# Altium project SparkFun_Motor_Driver-TB6612FNG_v11c.PrjPCB
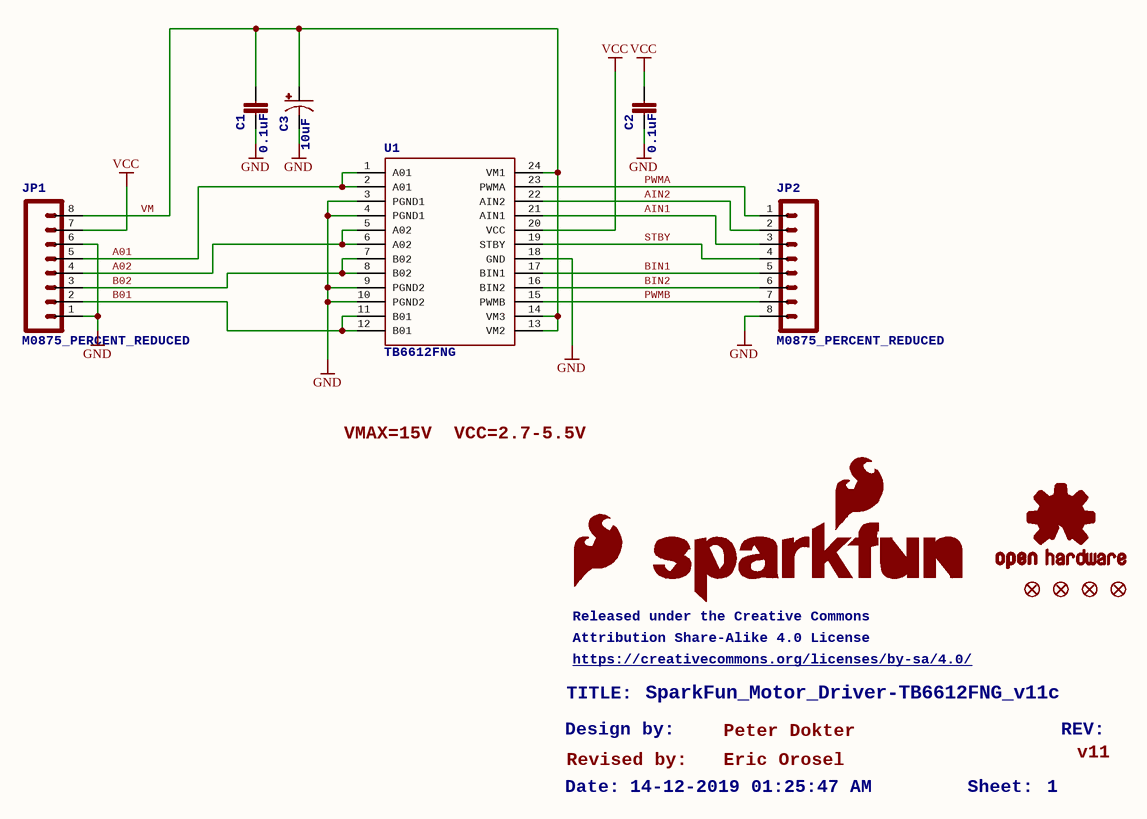
[diagram p0: SparkFun_Motor_Driver-TB6612FNG_v11c.SchDoc]
1 sheet, 13 parts. Net scope: global (net labels, ports and power ports of the same name join across sheets).

## Sheet SparkFun_Motor_Driver-TB6612FNG_v11c.SchDoc: SparkFun_Motor_Driver-TB6612FNG_v11c
size 270 x 207 mm; Date: 14-12-2019 01:25:47 AM; SheetNumber: 1

### Parts
C1  0.1uF  [0402]
C2  0.1uF  [0402]
C3  10uF  [EIA3528]
FD1  FIDUCIALUFIDUCIAL  [FIDUCIAL-MICRO]  (value not drawn)
FD2  FIDUCIALUFIDUCIAL  [FIDUCIAL-MICRO]  (value not drawn)
FD3  FIDUCIALUFIDUCIAL  [FIDUCIAL-MICRO]  (value not drawn)
FD4  FIDUCIALUFIDUCIAL  [FIDUCIAL-MICRO]  (value not drawn)
JP1  M0875_PERCENT_REDUCED  [1X08_OFFSET_REDUCED]
JP2  M0875_PERCENT_REDUCED  [1X08_OFFSET_REDUCED]
LOGO1  SFE_LOGO_FLAME.1_INCH  [SFE_LOGO_FLAME_.1]  (value not drawn)
LOGO2  OSHW-LOGOS  [OSHW-LOGO-S]  (value not drawn)
LOGO4  SFE_LOGO_NAME_FLAME.1_INCH  [SFE_LOGO_NAME_FLAME_.1]  (value not drawn)
U1  TB6612FNG  [SSOP24]

### Nets
GND: C1.2 C2.2 C3.C(-) JP1.1 JP1.6 JP2.8 U1.3(PGND1) U1.4(PGND1) U1.9(PGND2) U1.10(PGND2) U1.18(GND)
VCC: C2.1 JP1.7 U1.20(VCC)
A01: JP1.5 U1.1(A01) U1.2(A01)
A02: JP1.4 U1.5(A02) U1.6(A02)
AIN1: JP2.3 U1.21(AIN1)
AIN2: JP2.2 U1.22(AIN2)
B01: JP1.2 U1.11(B01) U1.12(B01)
B02: JP1.3 U1.7(B02) U1.8(B02)
BIN1: JP2.5 U1.17(BIN1)
BIN2: JP2.6 U1.16(BIN2)
PWMA: JP2.1 U1.23(PWMA)
PWMB: JP2.7 U1.15(PWMB)
STBY: JP2.4 U1.19(STBY)
VM: C1.1 C3.A(+) JP1.8 U1.13(VM2) U1.14(VM3) U1.24(VM1)

### Notes on the sheet
- VMAX=15V
  VCC=2.7-5.5V
- (near LOGO4) Released under the Creative Commons
- Attribution Share-Alike 4.0 License
- https://creativecommons.org/licenses/by-sa/4.0/
- Design by:
- TITLE:
- SparkFun_Motor_Driver-TB6612FNG_v11c
- Peter Dokter
- REV:
- Date:
- Revised by:
- 14-12-2019 01:25:47 AM
- Eric Orosel
- Sheet:
- 1
- v11

### Library data of the parts
C1 C2 = 0.1UF-0402-16V-10%: 0.1µF ceramic capacitors    A capacitor is a passive two-terminal electrical component used to store electrical energy temporarily in an electric field.
C3 = 10UF-POLAR-EIA3528-20V-10%(TANT): 10.0µF polarized capacitors    A capacitor is a passive two-terminal electrical component used to store electrical energy temporarily in an electric field.
FD1-FD4 = FIDUCIALUFIDUCIAL: Fiducial Alignment Points    Point-of-reference for pick-and-place machines and other optical instruments.
JP1 JP2 = M0875_PERCENT_REDUCED: Header 8Standard 8-pin 0.1" header. Use with straight break away headers (SKU : PRT-00116), right angle break away headers (PRT-00553), swiss pins (PRT-00743), machine pins (PRT-00117), and female headers (PRT-00115).
LOGO1 = SFE_LOGO_FLAME.1_INCH: SparkFun Flame Logo    This is the SparkFun flame logo. The logo on the schematic will always be the same size; the package variant is the height of the flame. Default layer for the logo on the board is tSilk.
LOGO2 = OSHW-LOGOS: Open-Source Hardware (OSHW) Logo     This logo indicates the piece of hardware it is found on incorporates a OSHW license and/or adheres to the definition of open source hardware found here: http://freedomdefined.org/OSHW
LOGO4 = SFE_LOGO_NAME_FLAME.1_INCH: SparkFun Font Logo w/ Flame    This is the SparkFun full logo. The logo on the schematic will always be the same size; the package variant is the height of the flame part of the logo. Default layer for the logo on the board is tSilk.
U1 = TB6612FNG: Toshiba 1A dual motor driver IC-09363; PROD_ID: IC-09363; VALUE: TB6612FNG